# EAGLE schematic PCB_sch_iter2 (EAGLE 9.6.2)
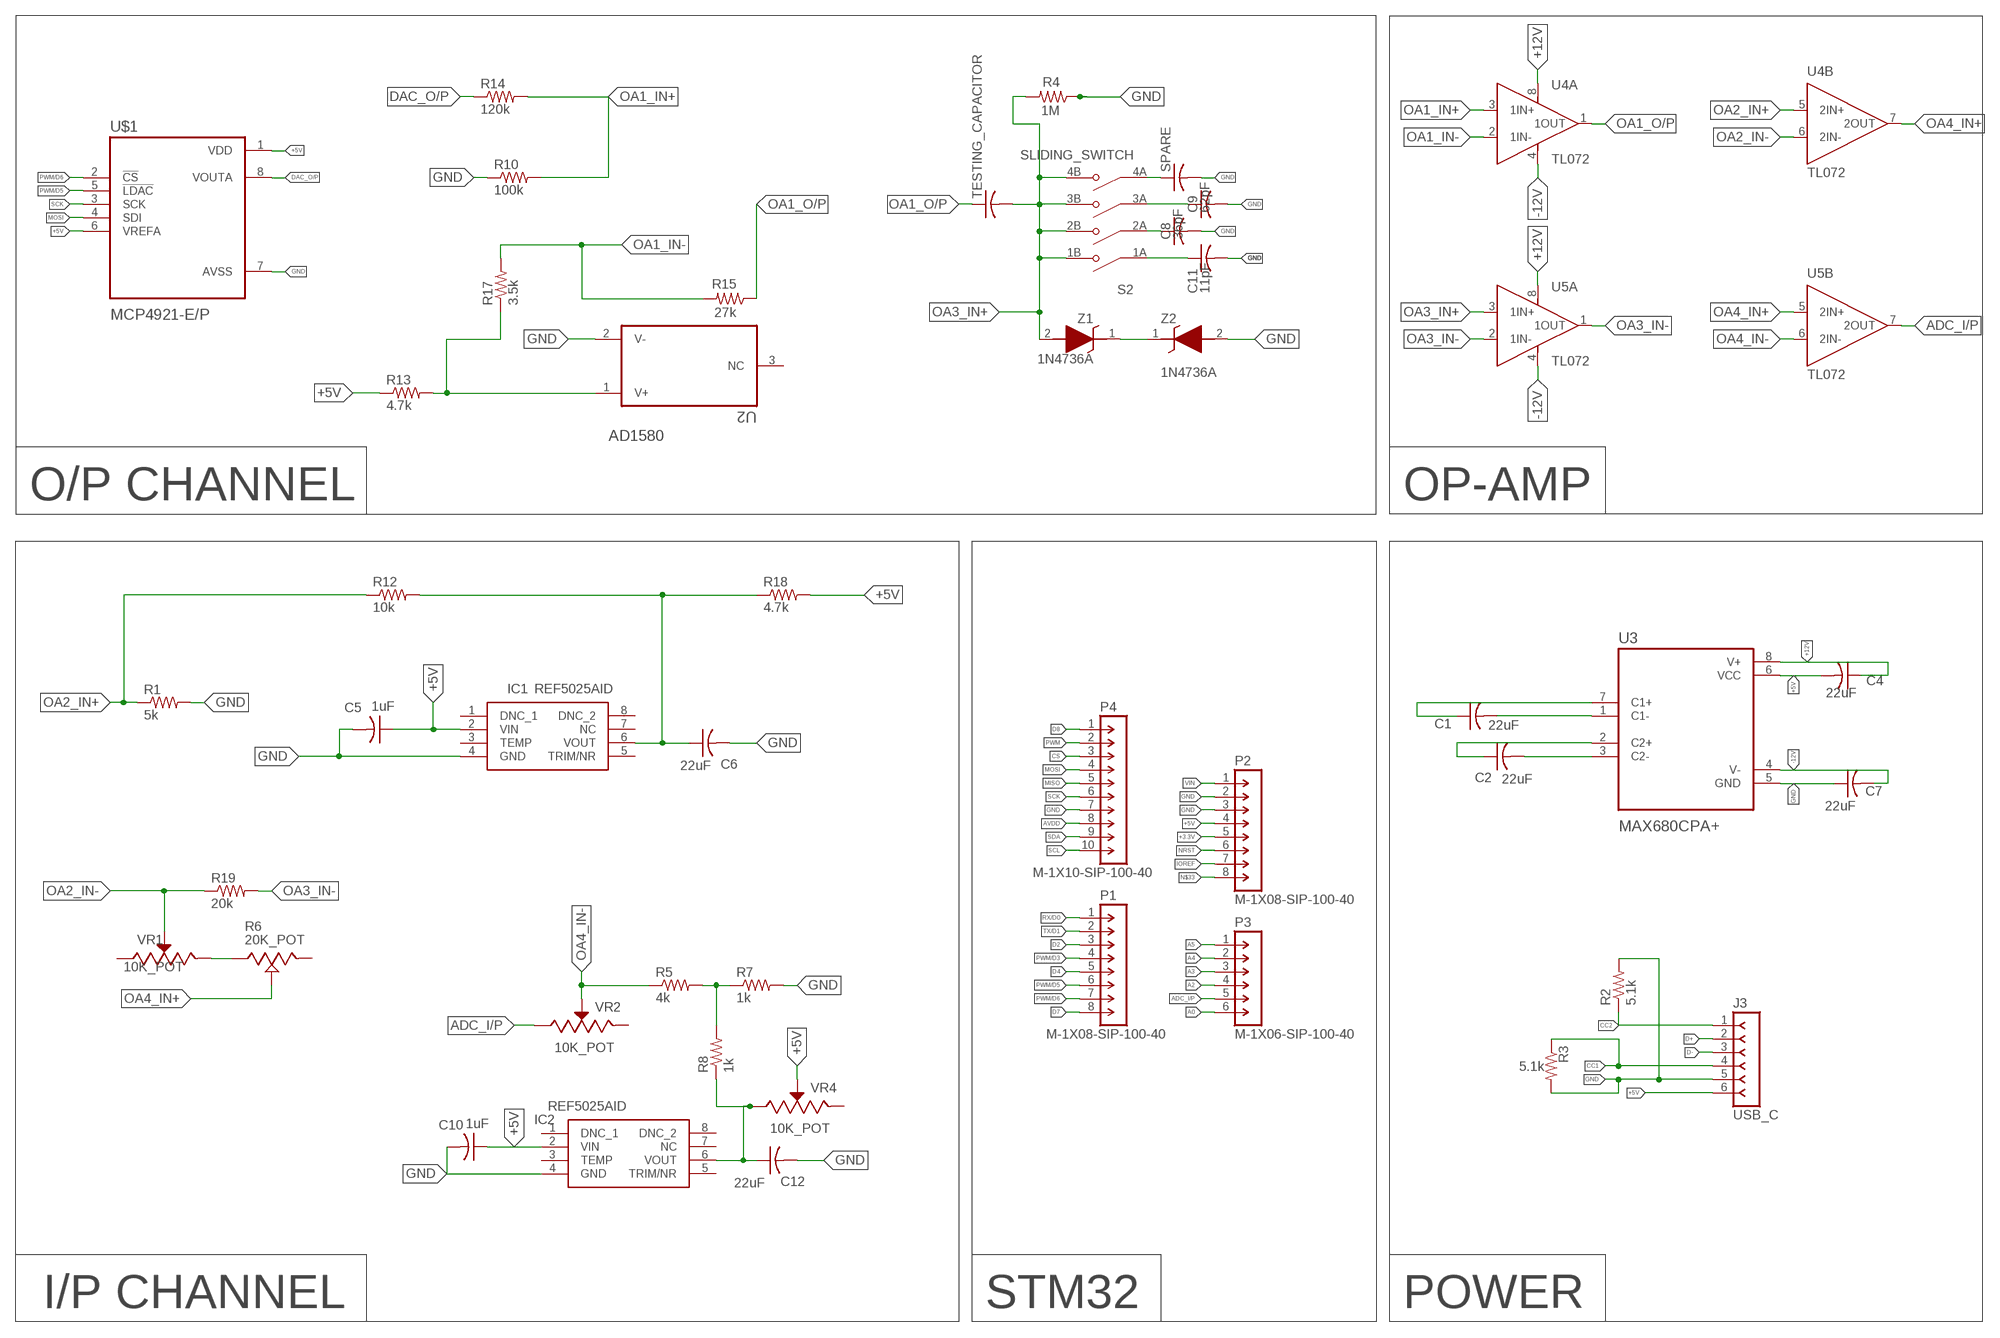
[diagram p0: schematic, sheet 1]

## Parts
C1  22uF  C-USC1206  [C1206]
C2  22uF  C-USC1206  [C1206]
C4  22uF  C-USC1206  [C1206]
C5  1uF  C-USC1206  [C1206]
C6  22uF  C-USC1206  [C1206]
C7  22uF  C-USC1206  [C1206]
C8  36pF  C-USC0805  [C0805]
C9  62pF  C-USC0805  [C0805]
C10  1uF  C-USC1206  [C1206]
C11  11pF  C-USC0805  [C0805]
C12  22uF  C-USC1206  [C1206]
IC1  REF5025AID  [SOIC127P600X175-8N]
IC2  REF5025AID  [SOIC127P600X175-8N]
J3  USB_C  F-1X06-SIP-100-40Y  [SIP-100-06-40Y]
P1  M-1X08-SIP-100-40  [SIP-100-08-40]
P2  M-1X08-SIP-100-40  [SIP-100-08-40]
P3  M-1X06-SIP-100-40  [SIP-100-06-40]
P4  M-1X10-SIP-100-40  [SIP-100-10-40]
R1  5k  R-US_M1206  [M1206]
R2  5.1k  R-US_R1206  [R1206]
R3  5.1k  R-US_R1206  [R1206]
R4  1M  R-US_M1206  [M1206]
R5  4k  R-US_M1206  [M1206]
R6  20K_POT  3296X-1-203LF  [TRIM_3296X-1-203LF]
R7  1k  R-US_M1206  [M1206]
R8  1k  R-US_M1206  [M1206]
R10  100k  R-US_M1206  [M1206]
R12  10k  R-US_M1206  [M1206]
R13  4.7k  R-US_M1206  [M1206]
R14  120k  R-US_M1206  [M1206]
R15  27k  R-US_M1206  [M1206]
R17  3.5k  R-US_M1206  [M1206]
R18  4.7k  R-US_M1206  [M1206]
R19  20k  R-US_M1206  [M1206]
S2  SLIDING_SWITCH  DS01C-254-S-04BE  [SW_DS01C-254-S-04BE]
SPARE  C-USC0805  [C0805]
TESTING_CAPACITOR  C-US050-030X075  [C050-030X075]
U2  AD1580  AD1580BRTZ-R2-REEL7  [SOT96P237X112-3N]
U3  MAX680CPA+  [DIP794W47P254L991H457Q8]
U4  TL072  [DIP794W45P254L1060H508Q8]
U5  TL072  [DIP794W45P254L1060H508Q8]
U$1  MCP4921-E/P  [DIP787W46P254L927H533Q8]
VR1  10K_POT  3296W-1-103RLF  [TRIM_3296W-1-103RLF]
VR2  10K_POT  3296W-1-103RLF  [TRIM_3296W-1-103RLF]
VR4  10K_POT  3296W-1-103RLF  [TRIM_3296W-1-103RLF]
Z1  1N4736A  [DIOAD1413W86L463D238]
Z2  1N4736A  [DIOAD1413W86L463D238]

## Nets
+3.3V: P2.5
+5V: C4.2 C5.1 C10.1 IC1.2(VIN) IC2.2(VIN) J3.6 P2.4 R13.1 R18.2 U3.6(VCC) U$1.1(VDD) U$1.6(VREFA) VR4.2(WIPER)
+12V: C4.1 U3.8(V+) U4.8(A:VCC+) U5.8(A:VCC+)
-12V: C7.2 U3.4(V-) U4.4(A:VCC-) U5.4(A:VCC-)
A0: P3.6
A2: P3.4
A3: P3.3
A4: P3.2
A5: P3.1
ADC_I/P: P3.5 U5.7(B:2OUT) VR2.1(CCW)
AVDD: P4.8
CC1: J3.4 R3.1
CC2: J3.1 R2.1
CS: P4.3
D2: P1.3
D4: P1.5
D7: P1.8
D8: P4.1
D+: J3.2
D-: J3.3
DAC_O/P: R14.1 U$1.8(VOUTA)
GND: C5.2 C6.2 C7.1 C8.2 C9.2 C10.2 C11.2 C12.2 IC1.4(GND) IC2.4(GND) J3.5 P2.2 P2.3 P4.7 R1.2 R2.2 R3.2 R4.1 R7.2 R10.1 SPARE.2 U2.2(V-) U3.5(GND) U$1.7(AVSS) Z2.2(A)
IOREF: P2.7
MISO: P4.5
MOSI: P4.4 U$1.4(SDI)
N$1: R6.1(CCW) VR1.3(CW)
N$2: R5.2 R7.1 R8.2
N$3: C12.1 IC2.6(VOUT) R8.1 VR4.1(CCW)
N$5: C1.2 U3.1(C1-)
N$6: R13.2 R17.1 U2.1(V+)
N$7: C6.1 IC1.6(VOUT) R12.2 R18.1
N$8: Z1.1(K) Z2.1(K)
N$9: C1.1 U3.7(C1+)
N$10: C2.2 U3.3(C2-)
N$11: C2.1 U3.2(C2+)
N$12: C9.1 S2.3A(COM3)
N$13: S2.4A(COM4) SPARE.1
N$14: C11.1 S2.1A(COM1)
N$15: C8.1 S2.2A(COM2)
N$33: P2.8
NRST: P2.6
OA1_IN+: R10.2 R14.2 U4.3(A:1IN+)
OA1_IN-: R15.2 R17.2 U4.2(A:1IN-)
OA1_O/P: R15.1 TESTING_CAPACITOR.1 U4.1(A:1OUT)
OA2_IN+: R1.1 R12.1 U4.5(B:2IN+)
OA2_IN-: R19.1 U4.6(B:2IN-) VR1.2(WIPER)
OA3_IN+: R4.2 S2.1B(NO1) S2.2B(NO2) S2.3B(NO3) S2.4B(NO4) TESTING_CAPACITOR.2 U5.3(A:1IN+) Z1.2(A)
OA3_IN-: R19.2 U5.1(A:1OUT) U5.2(A:1IN-)
OA4_IN+: R6.2(WIPER) U4.7(B:2OUT) U5.5(B:2IN+)
OA4_IN-: R5.1 U5.6(B:2IN-) VR2.2(WIPER)
PWM: P4.2
PWM/D3: P1.4
PWM/D5: P1.6 U$1.5(!LDAC)
PWM/D6: P1.7 U$1.2(!CS)
RX/D0: P1.1
SCK: P4.6 U$1.3(SCK)
SCL: P4.10
SDA: P4.9
TX/D1: P1.2
VIN: P2.1
Unconnected: IC1.1(DNC_1) IC1.3(TEMP) IC1.5(TRIM/NR) IC1.7(NC) IC1.8(DNC_2) IC2.1(DNC_1) IC2.3(TEMP) IC2.5(TRIM/NR) IC2.7(NC) IC2.8(DNC_2) R6.3(CW) U2.3(NC) VR1.1(CCW) VR2.3(CW) VR4.3(CW)

## Notes on the sheet
- O/P CHANNEL | OP-AMP
- I/P CHANNEL | STM32 | POWER

## Library data of the parts
C1 C2 C4-C10 C12 SPARE TESTING_CAPACITOR = adafruit:C-US: CAPACITOR, American symbol
C11 = adafruit:C-US: CAPACITOR, American symbol; SPICEPREFIX: C
IC1 IC2 = REF5025AID:REF5025AID: 3 Vpp/V Noise, 3 ppm/C Drift Precision Series Voltage Reference Source: Datasheet <http://www.ti.com/lit/ds/symlink/ref5025.pdf>; DESCRIPTION: 3 Vpp/V Noise, 3 ppm/C Drift Precision Series Voltage Reference; HEIGHT: 1.75mm; MANUFACTURER_NAME: Texas Instruments; MANUFACTURER_PART_NUMBER: REF5025AID; MOUSER_PART_NUMBER: 595-REF5025AID; MOUSER_PRICE-STOCK: https://www.mouser.co.uk/ProductDetail/Texas-Instruments/REF5025AID?qs=xL7PkI2RoJ6OzMm6G7%2FePw%3D%3D
J3 = con-headers-jp:F-1X06-: FEMALE HEADER
P1 P2 = con-headers-jp:M-1X08-: MALE HEADER
P3 = con-headers-jp:M-1X06-: MALE HEADER
P4 = con-headers-jp:M-1X10-: MALE HEADER
R1-R5 R7 R8 R10 R12-R15 R17-R19 = adafruit:R-US_: RESISTOR, American symbol
R6 = 3296X-1-203LF:3296X-1-203LF: Res Cermet Trimmer 20K Ohm 10% 1/2W 25(Elec)Turn 2.19mm (11.05 X 4.83 X 10.03mm) Pin Thru-Hole Tube Check availability <https://pricing.snapeda.com/parts/3296X-1-203LF/Bourns/view-part?ref=eda>; AVAILABILITY: In Stock; CHECK_PRICES: https://www.snapeda.com/parts/3296X-1-203LF/Bourns/view-part/?ref=eda; DESCRIPTION: Trimmer, Cermet, Rest 20 Kilohms, PCB, 25 Turns, Pwr-Rtg 0.5W | Bourns 3296X-1-203LF; MF: Bourns; MP: 3296X-1-203LF; PACKAGE: SOD-123 Bourns; PRICE: None; PURCHASE-URL: https://www.snapeda.com/api/url_track_click_mouser/?unipart_id=270465&manufacturer=Bourns&part_name=3296X-1-203LF&search_term=None; SNAPEDA_LINK: https://www.snapeda.com/parts/3296X-1-203LF/Bourns/view-part/?ref=snap
S2 = DS01C-254-S-04BE:DS01C-254-S-04BE; MANUFACTURER: CUI; MAXIMUM_PACKAGE_HEIGHT: 7.0mm; PARTREV: 1.0; STANDARD: Manufacturer recommendations
U2 = AD1580BRTZ-R2-REEL7:AD1580BRTZ-R2-REEL7
U3 = MAX680CPA_:MAX680CPA+: None Check availability <https://pricing.snapeda.com/parts/MAX680CPA%2B/Maxim%20Integrated%20Products/view-part?ref=eda>; AVAILABILITY: In Stock; CHECK_PRICES: https://www.snapeda.com/parts/MAX680CPA+/Analog+Devices/view-part/?ref=eda; DESCRIPTION: Charge Pump Switching Regulator IC Positive and Negative (Dual Rail) Fixed ±2Vin 2 Output 10mA 8-DIP (0.300, 7.62mm); MF: Maxim Integrated Products; MP: MAX680CPA+; PACKAGE: None; PRICE: None; SNAPEDA_LINK: https://www.snapeda.com/parts/MAX680CPA+/Analog+Devices/view-part/?ref=snap
U4 U5 = TL072:TL072: Wide Bandwidth Dual JFET Input Operational Amplifier 8-PDIP 0 to 70 Check availability <https://pricing.snapeda.com/parts/TL072/Texas%20Instruments/view-part?ref=eda>; AVAILABILITY: In Stock; CHECK_PRICES: https://www.snapeda.com/parts/TL072/Texas+Instruments/view-part/?ref=eda; DESCRIPTION: Operational Amplifiers - Op Amps Dual Lo-Noise JFET Input Op Amp; MF: Texas Instruments; MP: TL072; PACKAGE: None; PRICE: None; SNAPEDA_LINK: https://www.snapeda.com/parts/TL072/Texas+Instruments/view-part/?ref=snap
U$1 = MCP4921-E_P:MCP4921-E/P; CHECK_PRICES: https://www.snapeda.com/parts/MCP4921-E/P/Microchip/view-part/?ref=eda; DESCRIPTION: Microchip 12 bit Serial DAC 8-Pin PDIP | Microchip Technology Inc. MCP4921-E/P; MF: Microchip; MP: MCP4921-E/P; PACKAGE: DIP-8 Microchip; PURCHASE-URL: https://www.snapeda.com/api/url_track_click_mouser/?unipart_id=60&manufacturer=Microchip&part_name=MCP4921-E/P&search_term=mcp4921; SNAPEDA_LINK: https://www.snapeda.com/parts/MCP4921-E/P/Microchip/view-part/?ref=snap
VR1 VR2 VR4 = 3296W-1-103RLF:3296W-1-103RLF: Res Cermet Trimmer 500K Ohm 10% 0.5W 25(Elec)Turn 2.19mm (9.53 X 4.83 X 11.55mm) Pin Thru-Hole Tube Check availability <https://pricing.snapeda.com/parts/3296W-1-103RLF/Bourns/view-part?ref=eda>; AVAILABILITY: In Stock; CHECK_PRICES: https://www.snapeda.com/parts/3296W-1-103RLF/Bourns/view-part/?ref=eda; DESCRIPTION: Trimmer, Cermet, Rest 10 Kilohms, PCB, 25 Turns, Pwr-Rtg 0.5W | Bourns 3296W-1-103RLF; MF: Bourns; MP: 3296W-1-103RLF; PACKAGE: NON STANDARD-3 Bourns; PRICE: None; PURCHASE-URL: https://www.snapeda.com/api/url_track_click_mouser/?unipart_id=480309&manufacturer=Bourns&part_name=3296W-1-103RLF&search_term=None; SNAPEDA_LINK: https://www.snapeda.com/parts/3296W-1-103RLF/Bourns/view-part/?ref=snap
Z1 Z2 = 1N4736A:1N4736A: 1N4736 - Zener Diode, 6.8V, 5%, 1W Source: Datasheet <https://www.onsemi.com/pdf/datasheet/1n4736at-d.pdf>; DESCRIPTION: 1N4736 - Zener Diode, 6.8V, 5%, 1W; HEIGHT: mm; MANUFACTURER_NAME: onsemi; MANUFACTURER_PART_NUMBER: 1N4736A; MOUSER_PART_NUMBER: 512-1N4736A; MOUSER_PRICE-STOCK: https://www.mouser.co.uk/ProductDetail/onsemi-Fairchild/1N4736A?qs=SSucg2PyLi6CNqBOqJ%2FVZw%3D%3D